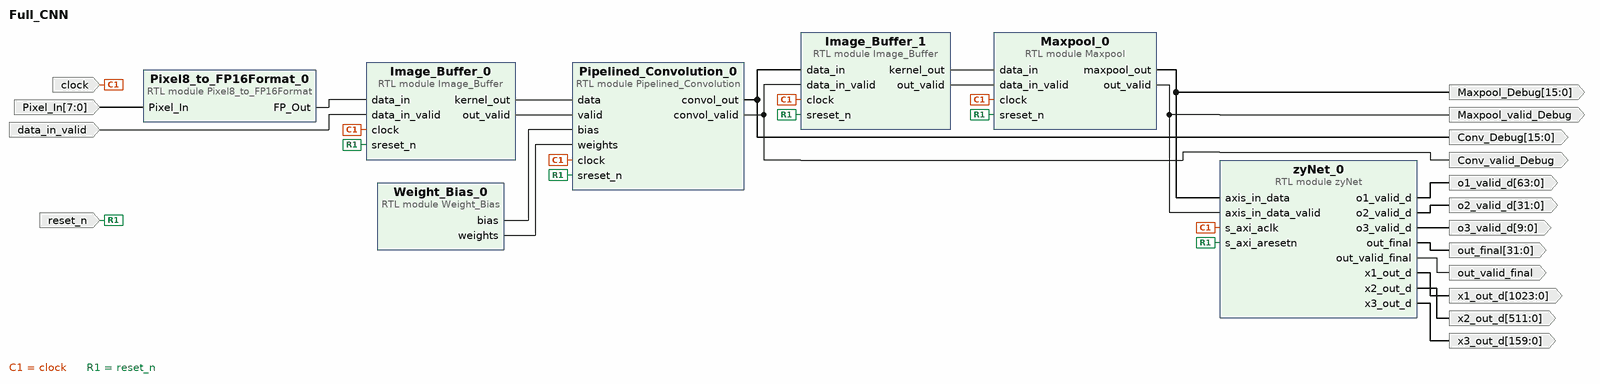
[diagram p0: block diagram of the top level]
# Vivado block design Full_CNN, xc7z020clg484-1, Vivado 2025.1
create_bd_design Full_CNN

create_bd_port -dir O -from 15 -to 0 Conv_Debug
create_bd_port -dir I -from 7 -to 0 Pixel_In
create_bd_port -dir I data_in_valid
create_bd_port -dir I -type clk clock
create_bd_port -dir I -type rst reset_n
create_bd_port -dir O -from 63 -to 0 o1_valid_d
create_bd_port -dir O -from 31 -to 0 o2_valid_d
create_bd_port -dir O -from 9 -to 0 o3_valid_d
create_bd_port -dir O -from 31 -to 0 out_final
create_bd_port -dir O out_valid_final
create_bd_port -dir O -from 1023 -to 0 x1_out_d
create_bd_port -dir O -from 511 -to 0 x2_out_d
create_bd_port -dir O -from 159 -to 0 x3_out_d
create_bd_port -dir O Conv_valid_Debug
create_bd_port -dir O -from 15 -to 0 Maxpool_Debug
create_bd_port -dir O Maxpool_valid_Debug

create_bd_cell -type module -reference Pixel8_to_FP16Format Pixel8_to_FP16Format_0
create_bd_cell -type module -reference Pipelined_Convolution Pipelined_Convolution_0
create_bd_cell -type module -reference Maxpool Maxpool_0
set_property -dict {CONFIG.COLUMN_SIZE 26 CONFIG.ROW_SIZE 26} [get_bd_cells Maxpool_0]
create_bd_cell -type module -reference zyNet zyNet_0
create_bd_cell -type module -reference Image_Buffer Image_Buffer_0
set_property -dict {CONFIG.COLUMN_SIZE 28 CONFIG.ROW_SIZE 28} [get_bd_cells Image_Buffer_0]
create_bd_cell -type module -reference Image_Buffer Image_Buffer_1
set_property -dict {CONFIG.COLUMN_SIZE 26 CONFIG.KERNEL_SIZE 2 CONFIG.ROW_SIZE 26} [get_bd_cells Image_Buffer_1]
create_bd_cell -type module -reference Weight_Bias Weight_Bias_0

# ---- connections ----

connect_bd_net [get_bd_pins Image_Buffer_0/kernel_out] [get_bd_pins Pipelined_Convolution_0/data]
connect_bd_net [get_bd_pins Image_Buffer_0/out_valid] [get_bd_pins Pipelined_Convolution_0/valid]
connect_bd_net [get_bd_pins Image_Buffer_1/kernel_out] [get_bd_pins Maxpool_0/data_in]
connect_bd_net [get_bd_pins Image_Buffer_1/out_valid] [get_bd_pins Maxpool_0/data_in_valid]
connect_bd_net [get_bd_pins Maxpool_0/maxpool_out] [get_bd_ports Maxpool_Debug] [get_bd_pins zyNet_0/axis_in_data]
connect_bd_net [get_bd_pins Maxpool_0/out_valid] [get_bd_ports Maxpool_valid_Debug] [get_bd_pins zyNet_0/axis_in_data_valid]
connect_bd_net [get_bd_pins Pipelined_Convolution_0/convol_out] [get_bd_ports Conv_Debug] [get_bd_pins Image_Buffer_1/data_in]
connect_bd_net [get_bd_pins Pipelined_Convolution_0/convol_valid] [get_bd_ports Conv_valid_Debug] [get_bd_pins Image_Buffer_1/data_in_valid]
connect_bd_net [get_bd_pins Pixel8_to_FP16Format_0/FP_Out] [get_bd_pins Image_Buffer_0/data_in]
connect_bd_net -net Pixel_In_0_1 [get_bd_ports Pixel_In] [get_bd_pins Pixel8_to_FP16Format_0/Pixel_In]
connect_bd_net [get_bd_pins Weight_Bias_0/bias] [get_bd_pins Pipelined_Convolution_0/bias]
connect_bd_net [get_bd_pins Weight_Bias_0/weights] [get_bd_pins Pipelined_Convolution_0/weights]
connect_bd_net -net clock_0_2 [get_bd_ports clock] \
  [get_bd_pins Pipelined_Convolution_0/clock] [get_bd_pins Maxpool_0/clock] [get_bd_pins Image_Buffer_0/clock] \
  [get_bd_pins Image_Buffer_1/clock] [get_bd_pins zyNet_0/s_axi_aclk]
connect_bd_net -net data_in_valid_0_1 [get_bd_ports data_in_valid] [get_bd_pins Image_Buffer_0/data_in_valid]
connect_bd_net -net s_axi_aresetn_0_1 [get_bd_ports reset_n] \
  [get_bd_pins Pipelined_Convolution_0/sreset_n] [get_bd_pins Maxpool_0/sreset_n] [get_bd_pins Image_Buffer_0/sreset_n] \
  [get_bd_pins Image_Buffer_1/sreset_n] [get_bd_pins zyNet_0/s_axi_aresetn]
connect_bd_net [get_bd_pins zyNet_0/o1_valid_d] [get_bd_ports o1_valid_d]
connect_bd_net [get_bd_pins zyNet_0/o2_valid_d] [get_bd_ports o2_valid_d]
connect_bd_net [get_bd_pins zyNet_0/o3_valid_d] [get_bd_ports o3_valid_d]
connect_bd_net [get_bd_pins zyNet_0/out_final] [get_bd_ports out_final]
connect_bd_net [get_bd_pins zyNet_0/out_valid_final] [get_bd_ports out_valid_final]
connect_bd_net [get_bd_pins zyNet_0/x1_out_d] [get_bd_ports x1_out_d]
connect_bd_net [get_bd_pins zyNet_0/x2_out_d] [get_bd_ports x2_out_d]
connect_bd_net [get_bd_pins zyNet_0/x3_out_d] [get_bd_ports x3_out_d]

validate_bd_design
save_bd_design
